# EAGLE design Pure VCA (EAGLE 9.6.2)

## Sheet 1 of 2
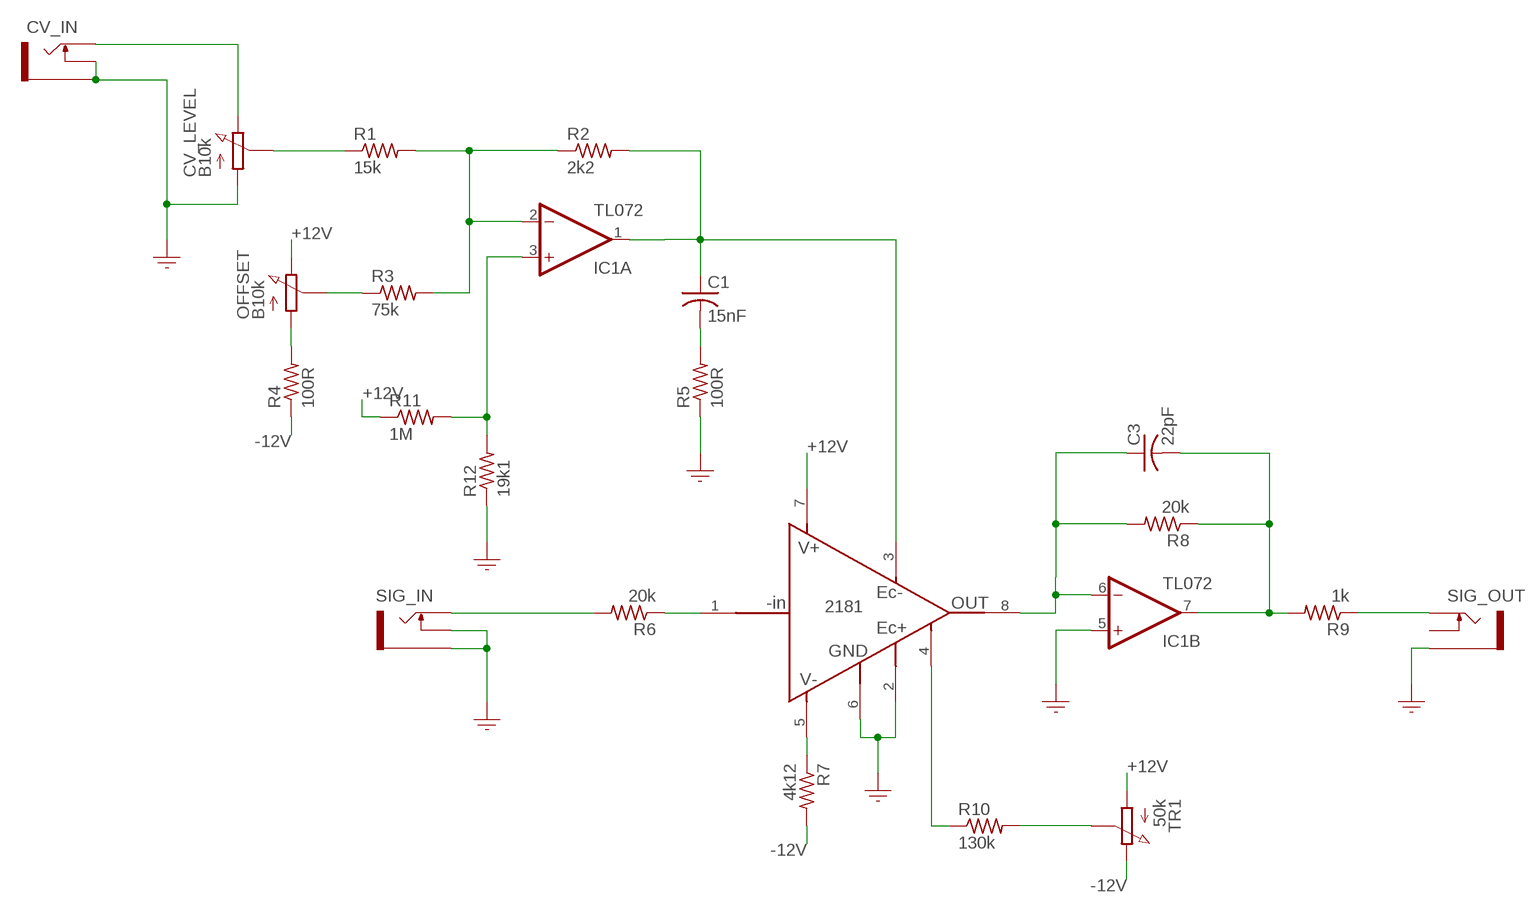
[diagram p0: schematic, sheet 1]

### Parts
C1  15nF  CAPACITOR-USC0805  [C0805]
C3  22pF  CAPACITOR-USC0805  [C0805]
CV_IN  PJ301M-12  SOCKET_MONO_3.5MMPJ301M-12  [PJ301M-12]
CV_LEVEL  B10k  RESISTOR_VARIABLEPOT_9MM_GREEN_KNOB  [POT_9MM_GREEN_KNOB]
IC1  TL072  OPAMP_DUALD  [SO08]
IC2  THAT2181  VCA_THAT2181  [SOIC--8]
OFFSET  B10k  RESISTOR_VARIABLEPOT_9MM_BLUE_KNOB  [POT_9MM_BLUE_KNOB]
R1  15k  RESISTOR_USR0805  [R0805]
R2  2k2  RESISTOR_USR0805  [R0805]
R3  75k  RESISTOR_USR0805  [R0805]
R4  100R  RESISTOR_USR0805  [R0805]
R5  100R  RESISTOR_USR0805  [R0805]
R6  20k  RESISTOR_USR0805  [R0805]
R7  4k12  RESISTOR_USR0805  [R0805]
R8  20k  RESISTOR_USR0805  [R0805]
R9  1k  RESISTOR_USR0805  [R0805]
R10  130k  RESISTOR_USR0805  [R0805]
R11  1M  RESISTOR_USR0805  [R0805]
R12  19k1  RESISTOR_USR0805  [R0805]
SIG_IN  PJ301M-12  SOCKET_MONO_3.5MMPJ301M-12  [PJ301M-12]
SIG_OUT  PJ301M-12  SOCKET_MONO_3.5MMPJ301M-12  [PJ301M-12]
TR1  50k  RESISTOR_VARIABLETRIMMER_TH  [TRIMMER_TH]

### Nets
+12V: IC2.7(V+) OFFSET.P$3 R11.1 TR1.1 ; also sheet 2
-12V: R4.1 R7.2 TR1.3 ; also sheet 2
GND: CV_IN.GND(SLEEVE) CV_IN.NORM(SWITCH) CV_LEVEL.P$1 IC1.5(B:+IN) IC2.2(EC+) IC2.6(GND) R5.1 R12.1 SIG_IN.GND(SLEEVE) SIG_IN.NORM(SWITCH) SIG_OUT.GND(SLEEVE) ; also sheet 2
N$1: CV_IN.TIP CV_LEVEL.P$3
N$2: IC1.2(A:-IN) R1.2 R2.1 R3.2
N$3: CV_LEVEL.P$2 R1.1
N$4: OFFSET.P$1 R4.2
N$5: C1.1 IC1.1(A:OUT) IC2.3(EC-) R2.2
N$6: OFFSET.P$2 R3.1
N$7: C1.2 R5.2
N$8: R9.1 SIG_OUT.TIP
N$9: IC2.1(-IN) R6.1
N$11: R6.2 SIG_IN.TIP
N$13: IC2.5(V-) R7.1
N$14: IC1.3(A:+IN) R11.2 R12.2
N$15: C3.1 IC1.6(B:-IN) IC2.8(OUT) R8.2
N$16: C3.2 IC1.7(B:OUT) R8.1 R9.2
N$17: IC2.4(SYM) R10.1
N$18: R10.2 TR1.2
Unconnected: SIG_OUT.NORM(SWITCH)

## Sheet 2 of 2
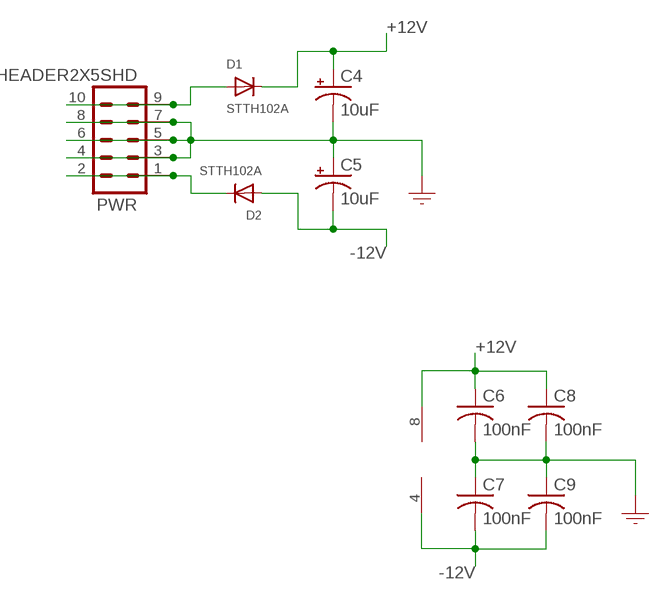
[diagram p1: schematic, sheet 2]

### Parts
C4  10uF  CAPACITOR_POL-US153CLV-0505  [153CLV-0505]
C5  10uF  CAPACITOR_POL-US153CLV-0505  [153CLV-0505]
C6  100nF  CAPACITOR-USC0805  [C0805]
C7  100nF  CAPACITOR-USC0805  [C0805]
C8  100nF  CAPACITOR-USC0805  [C0805]
C9  100nF  CAPACITOR-USC0805  [C0805]
D1  STTH102A  DIODESMA  [SMADIODE]
D2  STTH102A  DIODESMA  [SMADIODE]
PWR  HEADER2X5SHD  [2X5-SHROUDED]

### Nets
+12V: C4.+ C6.1 C8.1 D1.C IC1.8(P:V+) ; also sheet 1
-12V: C5.- C7.2 C9.2 D2.A IC1.4(P:V-) ; also sheet 1
GND: C4.- C5.+ C6.2 C7.1 C8.2 C9.1 PWR.3 PWR.4 PWR.5 PWR.6 PWR.7 PWR.8 ; also sheet 1
N$38: D1.A PWR.9 PWR.10
N$50: D2.C PWR.1 PWR.2

## Library data of the parts
C1 C3 C6-C9 = GMSN:CAPACITOR-US: Capacitor; SORT: 3
C4 C5 = GMSN:CAPACITOR_POL-US: Electro Capacitor; SORT: 3
CV_IN SIG_IN SIG_OUT = GMSN:SOCKET_MONO_3.5MM: 3.5 mm Jack Socket; SORT: 8
CV_LEVEL OFFSET = GMSN:RESISTOR_VARIABLE: Pot; SORT: 8
D1 D2 = GMSN:DIODE: Diode SMADIODE - SMA Surface Mount Package 20V 1A Schottky Diode Digikey: 641-1014-6-ND DO-1N4148 - Through Hole Small Current Diode SOD-123 20V 1 A (.5mV Vf) Schottky Diode - Digikey: MBRX120TPMSCT-ND SOD-323 10V 570mA (.38mV Vf, 3ns) Schottky Diode - Digikey: ZLLS410CT-ND SOD-523 30V 30mA Schottky Diode (RB751S-40TE61) - Digikey: RB751S-40TE61CT-ND SOT23-R/W - SOT23 Package (R = Solder Paste/Reflow Ovens, W = Hand-Soldering) BAT54Film 40V 300mA - Digikey: 497-7162-1-ND; SORT: 3.9
IC1 = GMSN:OPAMP_DUAL: Dual Op Amp; SORT: 4.5
IC2 = GMSN:VCA_THAT2181: THAT2181 VCA; SORT: 4
PWR = GMSN:HEADER2X5: Header 5x2 Standard 10-pin dual row 0.1" header. Commonly used with AVR-ISP. Use with Spark Fun Electronics SKU: PRT-00778; SORT: 7
R1-R12 = GMSN:RESISTOR_US: Resistor; SORT: 2
TR1 = GMSN:RESISTOR_VARIABLE: Pot; SORT: 7

## Board
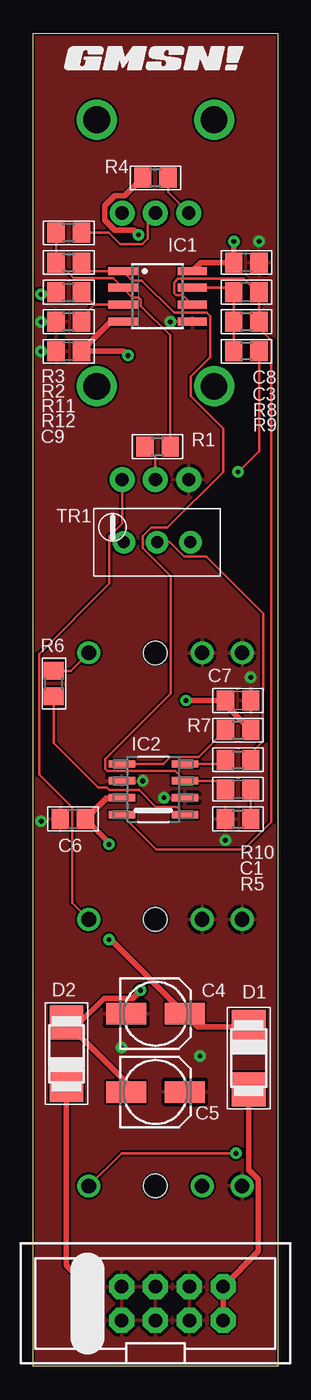
[diagram p2: board, top side]
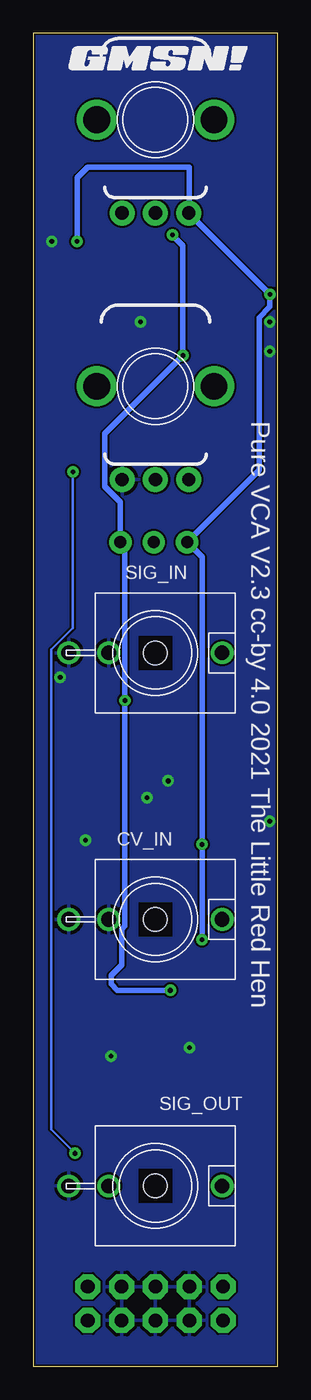
[diagram p3: board, bottom side, seen from below]

Size 18.32 x 100 mm. Coordinates in mm from the lower left corner, seen from the top.
Outline: 18.32,0 0,0 0,100 18.32,100 18.32,0
Copper layers (1*16): Top 0.035mm / dielectric 1.5mm / Bottom 0.035mm
Design rules "PCBWay": minimum track width 6mil, minimum drill 12mil, track to track 6mil, track to pad 6mil, pad to pad 6mil, via to via 6mil, smd to smd 6mil, copper to edge 6mil, drill to drill 6mil, minimum pad ring 12mil, minimum via ring 10mil, stop-mask expansion 4mil, vias tented up to drill 25mil, thermal gap 10mil

### Footprints (pad centres in the part's own frame; a part is rotated, then mirrored left to right if it is on the bottom)
C0805 = smd 1.3 x 1.5: 1 -0.95,0; 2 0.95,0
153CLV-0505 = smd 3 x 1.6: + 2.2,0; - -2.2,0
PJ301M-12 = drill 1.1: GND 0,-6.5; NORM 0,-3.5; TIP 0,5 | hole 1.778: 0,0
POT_9MM_GREEN_KNOB = drill 1 pad 1.88: P$1 -2.5,-7; P$2 0,-7; P$3 2.5,-7 | drill 2 pad 2.68: P$4 -4.4,0; P$5 4.4,0
SMADIODE = smd 2.54 x 2.54: A 2.349,0; C -2.349,0
SO08 = smd 0.6 x 2.2: 1 -1.905,-2.6; 2 -0.635,-2.6; 3 0.635,-2.6; 4 1.905,-2.6; 5 1.905,2.6; 6 0.635,2.6; 7 -0.635,2.6; 8 -1.905,2.6
SOIC--8 = smd 1.981 x 0.559: 1 -2.362,1.905; 2 -2.362,0.635; 3 -2.362,-0.635; 4 -2.362,-1.905; 5 2.362,-1.905; 6 2.362,-0.635; 7 2.362,0.635; 8 2.362,1.905
POT_9MM_BLUE_KNOB = drill 1 pad 1.88: P$1 -2.5,-7; P$2 0,-7; P$3 2.5,-7 | drill 2 pad 2.68: P$4 -4.4,0; P$5 4.4,0
2X5-SHROUDED = drill 1.016 pad 1.88 octagon: 1 -1.27,5.08; 2 1.27,5.08; 3 -1.27,2.54; 4 1.27,2.54; 5 -1.27,0; 6 1.27,0; 7 -1.27,-2.54; 8 1.27,-2.54; 9 -1.27,-5.08; 10 1.27,-5.08
R0805 = smd 1.3 x 1.5: 1 -0.95,0; 2 0.95,0
TRIMMER_TH = drill 0.9 pad 1.676: 1 -0.802,1.143; 2 -3.302,1.143; 3 -5.802,1.143

### Placement (x,y rotation side)
C1  15.35,43.28 0 top
C3  15.99,80.58 180 top
C4  9.16,26.44 0 top
C5  9.16,20.57 0 top
C6  2.97,41.05 180 top
C7  15.35,49.94 180 top
C8  15.99,82.81 0 top
C9  2.65,76.14 0 top
CV_IN  9.16,33.52 270 bottom
CV_LEVEL  9.16,73.52 0 bottom
D1  16.15,23.12 270 top
D2  2.48,23.43 90 top
IC1  9.32,80.27 270 top
IC2  9,43.28 180 top
OFFSET  9.16,93.52 0 bottom
PWR  9.16,4.7 90 top
R1  9.32,68.99 0 top
R2  2.65,82.81 0 top
R3  2.65,85.03 180 top
R4  9.16,89.16 0 top
R5  15.35,41.05 0 top
R6  1.54,51.21 90 top
R7  15.35,47.72 0 top
R8  15.99,78.36 0 top
R9  15.99,76.14 180 top
R10  15.35,45.5 0 top
R11  2.65,80.58 0 top
R12  2.65,78.36 0 top
SIG_IN  9.16,53.52 270 bottom
SIG_OUT  9.16,13.52 270 bottom
TR1  5.99,62.96 180 top
U$1  [GMSN!_LOGO]  9.32,98.05 0 top
U$2  [GMSN!_LOGO]  8.68,98.05 0 bottom

### Tracks (layer width: path | path; a pad name or v marks a point on that pad's centre or on a via)
+12V  (via drill 0.35)
  Top 0.406: D1.C 12.34,25.47 C4.+ 5.8,32.01 v5.67,32.01 | v5.67,39.15 5.67,39.31 C6.1 5.51,42.64 IC2.7 | v0.58,80.42 1.54,80.42 R11.1 | IC1.8 12.55,82.81 C8.1 v15.04,84.39 v15.03,84.39
  Bottom 0.406: v5.67,32.01 v5.67,39.15 5.67,60.7 TR1.1 1.37,67.23 1.37,78.69 0.58,79.48 v0.58,80.42 0.58,80.44 OFFSET.P$3 6.62,86.56 6.62,89.95 14.24,89.95 15.03,89.16 v15.03,84.39
-12V  (via drill 0.35)
  Top 0.406: C5.- 6.96,21.31 D2.A 3.5,25.78 5.31,27.6 7.45,27.6 v8.05,28.2 | v7.1,75.82 6.78,76.14 C9.2 5.82,78.36 IC1.4 | v7.89,84.87 7.54,85.22 6.12,85.22 5.37,85.98 5.37,87.06 6.12,87.81 6.87,87.81 R4.1 | v11.45,49.94 C7.2 14.4,49.62 15.41,48.62 R7.2
  Bottom 0.406: v7.89,84.87 7.1,84.08 v7.1,75.82 12.96,69.96 12.96,65.98 11.79,64.81 TR1.3 11.45,61.48 v11.45,49.94 11.45,33.02 11.7,32.77 11.7,30.1 12.48,29.32 12.48,28.67 12.03,28.21 v8.06,28.21 v8.05,28.2
GND  (via drill 0.35)
  other vias: 6.62,23.91 12.49,23.28 14.4,39.47 16.3,51.69 0.59,40.9 9.79,42.64 8.21,43.91 0.59,78.36 0.59,76.14 10.27,78.36 16.94,84.39
  pour Top: 18.32,100 0,100 0,0 18.32,0
  pour Bottom: 18.32,100 0,100 0,0 18.32,0
N$1
  Top 0.2: CV_LEVEL.P$3 6.66,63.23 5.7,62.27 5.7,58.7 0.43,53.44 0.43,44.4 2.92,41.91 2.92,34.76 CV_IN.TIP
N$2
  Top 0.2: R3.2 R2.1 1.84,82.81 3.03,81.62 6,81.62 IC1.2 7.44,80.18 7.92,80.18 8.07,80.04 8.07,79.55 10.27,77.35 R1.2
N$3
  Top 0.2: R1.1 9.16,68.2 CV_LEVEL.P$2
N$4
  Top 0.2: R4.2 10.11,88.07 OFFSET.P$1
N$5
  Top 0.2: R2.2 4.24,82.17 IC1.1 7.44,81.45 8.14,81.45 10.55,79.04 12.99,79.04 13.27,78.77 13.27,75.71 11.81,74.25 11.81,72.79 14.24,70.36 14.24,67.09 10.06,62.91 8.84,62.91 8.2,62.27 8.2,61.37 10.3,59.26 10.3,50.47 5.4,45.57 5.4,44.8 5.54,44.65 10.62,44.65 IC2.3 13.77,43.91 C1.1
N$6
  Top 0.2: R3.1 5.67,85.03 6.51,84.19 8.17,84.19 8.57,84.59 8.57,85.93 OFFSET.P$2
N$7
  Top 0.2: C1.2 R5.2
N$8  (via drill 0.35)
  Top 0.2: R9.1 16.94,68.67 v15.35,67.09 | v15.19,15.97 6.61,15.97 SIG_OUT.TIP
  Bottom 0.2: v15.35,67.09 15.35,55.39 16.98,53.76 16.98,17.76 v15.19,15.97
N$9
  Top 0.2: IC2.1 10.78,41.96 9.2,41.96 7.93,43.23 5.69,43.23 5.49,43.44 4.87,43.44 1.54,46.77 R6.1
N$11
  Top 0.2: R6.2 2.81,52.16 SIG_IN.TIP
N$13
  Top 0.2: R7.1 12.39,45.71 10.27,45.71 9.74,45.18 IC2.5
N$14
  Top 0.2: R11.2 4.55,79.63 | 4.55,79.63 IC1.3 | R12.2 3.6,78.68 4.55,79.63
N$15
  Top 0.2: IC1.6 11.2,80.35 10.71,80.35 10.57,80.5 10.57,81.31 10.85,81.59 15.79,81.59 16.79,80.58 C3.1 R8.2 16.94,77.9 17.84,76.99 17.84,40.83 15.79,38.79 9.22,38.79 IC2.8
N$16
  Top 0.2: IC1.7 14.72,80.9 C3.2 R8.1 R9.2
N$17
  Top 0.2: IC2.4 14.08,45.18 R10.1
N$18
  Top 0.2: R10.2 16.3,45.97 17.2,46.87 17.2,50.69 17.26,50.74 17.26,56.45 12.98,60.73 11.34,60.73 10.24,61.82 TR1.2
N$38
  Top 0.406: PWR.9 PWR.10 16.87,8.6 16.87,14.02 16.15,14.74 D1.A
N$50
  Top 0.406: PWR.1 PWR.2 2.48,7.57 D2.C

### Text on the board
tPlace: TR1
bPlace: Pure VCA V2.3 cc-by 4.0 2021 The Little Red Hen